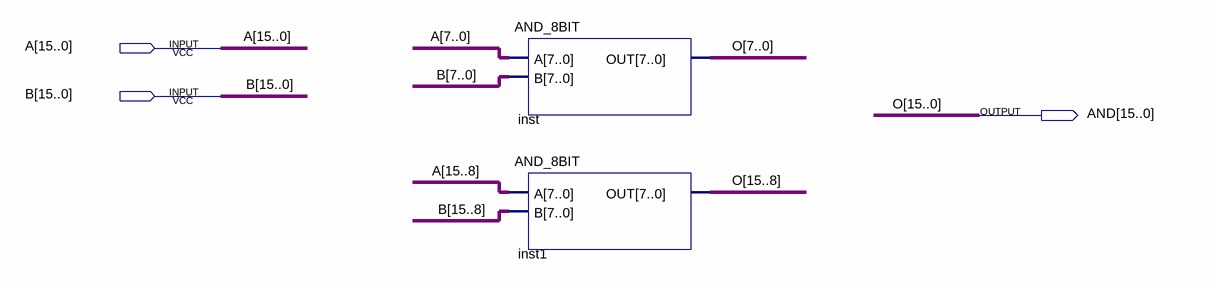
[diagram p0: schematic sheet]
// Quartus schematic AND_16BIT.bdf as structural Verilog: 2 symbols, 3 pins
module AND_16BIT (
  input  [15:0] A,
  input  [15:0] B,
  output [15:0] AND
);

  AND_8BIT inst (.A(A[7:0]), .B(B[7:0]), .OUT(AND[7:0]));
  AND_8BIT inst1 (.A(A[15:8]), .B(B[15:8]), .OUT(AND[15:8]));

  // Other names for the same wires on the sheet: O[15:0] = AND
endmodule
